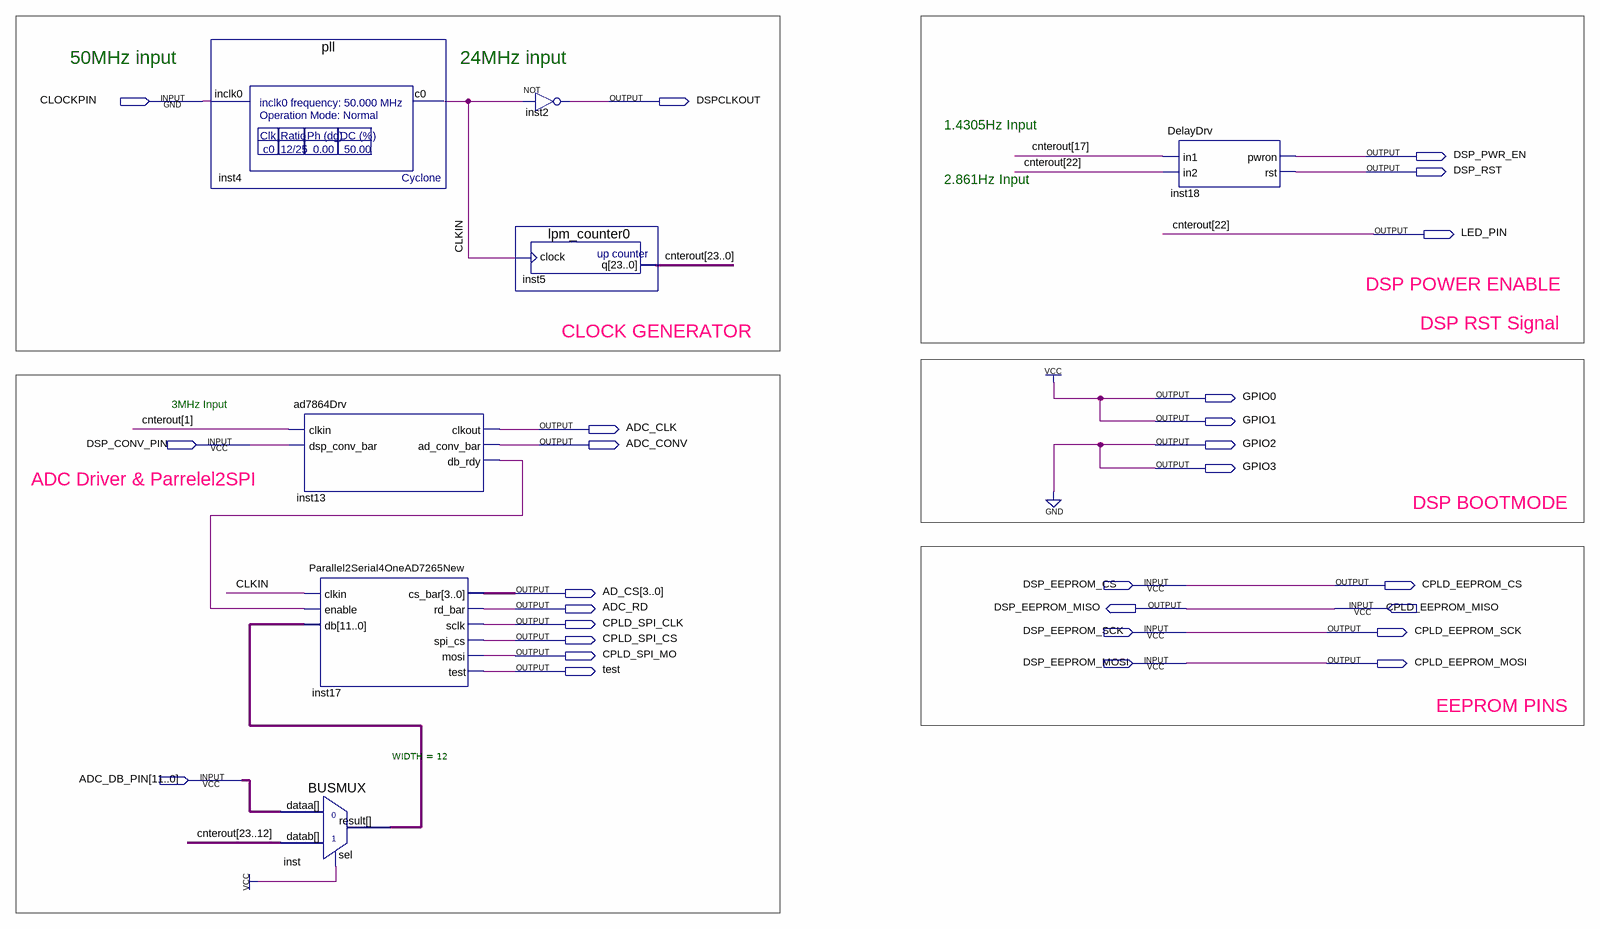
[diagram p0: schematic sheet]
// Quartus schematic basicfunctions.bdf as structural Verilog: 7 symbols, 27 pins
module basicfunctions (
  input  CLOCKPIN,
  input  DSP_CONV_PIN,
  input  DSP_EEPROM_CS,
  input  CPLD_EEPROM_MISO,
  input  DSP_EEPROM_SCK,
  input  DSP_EEPROM_MOSI,
  input  [11:0] ADC_DB_PIN,
  output DSPCLKOUT,
  output DSP_PWR_EN,
  output DSP_RST,
  output LED_PIN,
  output GPIO0,
  output GPIO1,
  output ADC_CLK,
  output ADC_CONV,
  output GPIO2,
  output GPIO3,
  output CPLD_EEPROM_CS,
  output [3:0] AD_CS,
  output ADC_RD,
  output DSP_EEPROM_MISO,
  output CPLD_SPI_CLK,
  output CPLD_EEPROM_SCK,
  output CPLD_SPI_CS,
  output CPLD_SPI_MO,
  output CPLD_EEPROM_MOSI,
  output test
);

  wire CLKIN, inst13_db_rdy;
  wire [11:0] inst_result;
  wire [23:0] cnterout;

  pll inst4 (.inclk0(CLOCKPIN), .c0(CLKIN));
  ad7864Drv inst13 (
    .clkin(cnterout[1]), .dsp_conv_bar(DSP_CONV_PIN), .clkout(ADC_CLK), .ad_conv_bar(ADC_CONV),
    .db_rdy(inst13_db_rdy));
  Parallel2Serial4OneAD7265New inst17 (
    .clkin(CLKIN), .enable(inst13_db_rdy), .db(inst_result), .cs_bar(AD_CS), .rd_bar(ADC_RD),
    .sclk(CPLD_SPI_CLK), .spi_cs(CPLD_SPI_CS), .mosi(CPLD_SPI_MO), .test(test));
  BUSMUX #(.WIDTH(12)) inst (
    .datab({cnterout[23], LED_PIN, cnterout[21:12]}), .sel(1'b1), .dataa(ADC_DB_PIN), .result(inst_result));
  not inst2 (DSPCLKOUT, CLKIN);
  lpm_counter0 inst5 (.clock(CLKIN), .q({cnterout[23], LED_PIN, cnterout[21:0]}));
  DelayDrv inst18 (.in1(cnterout[17]), .in2(LED_PIN), .pwron(DSP_PWR_EN), .rst(DSP_RST));

  assign CPLD_EEPROM_CS = DSP_EEPROM_CS;
  assign CPLD_EEPROM_MOSI = DSP_EEPROM_MOSI;
  assign CPLD_EEPROM_SCK = DSP_EEPROM_SCK;
  assign DSP_EEPROM_MISO = CPLD_EEPROM_MISO;
  assign GPIO0 = 1'b1;
  assign GPIO1 = 1'b1;
  assign GPIO2 = 1'b0;
  assign GPIO3 = 1'b0;

  // Other names for the same wires on the sheet: cnterout[22] = LED_PIN

  // Notes on the sheet:
  //   50MHz input
  //   24MHz input
  //   1.4305Hz Input
  //   2.861Hz Input
  //   DSP POWER ENABLE
  //   DSP RST Signal
  //   CLOCK GENERATOR
  //   3MHz Input
  //   ADC Driver & Parrelel2SPI
  //   DSP BOOTMODE
  //   EEPROM PINS
endmodule
